# Altium schematic sheet Hum_ADC.SchDoc
size A4
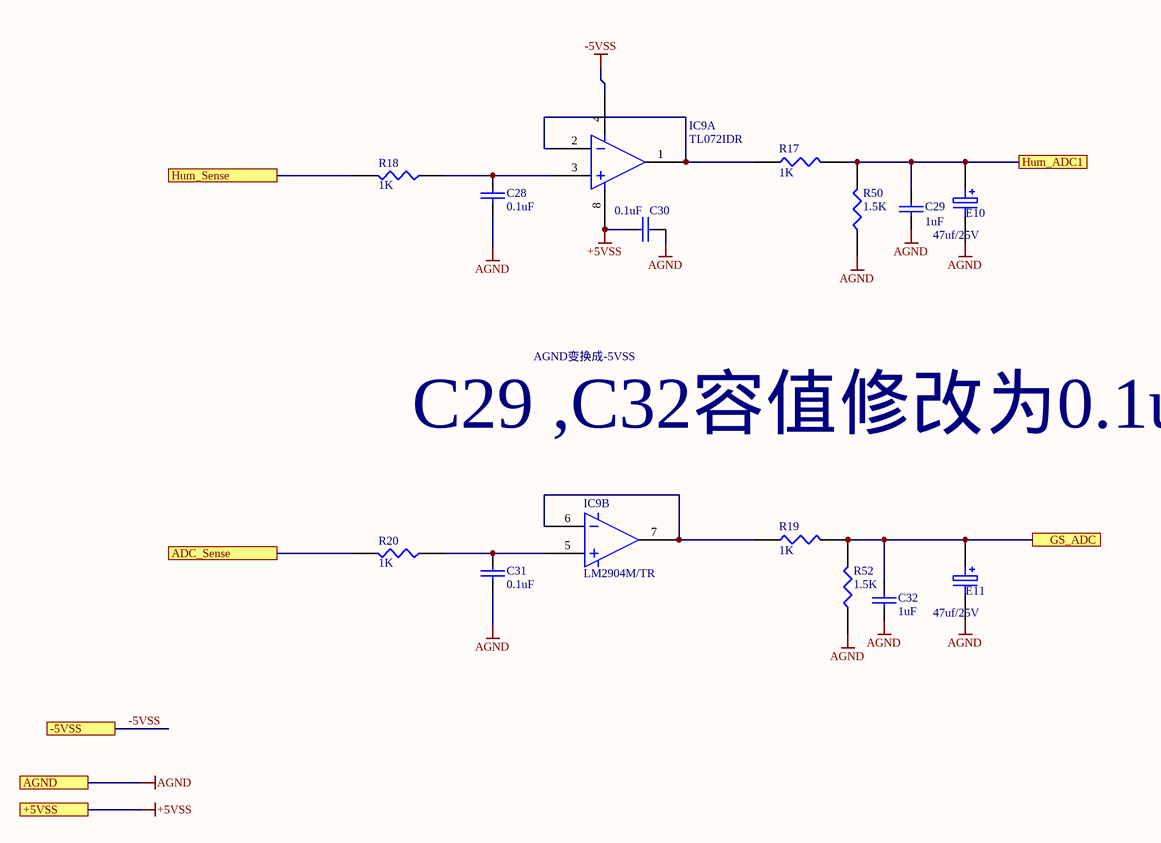
[diagram p0: Hum_ADC.SchDoc]

## Parts
C28  0.1uF  [0805C]
C29  1uF  [0805C]
C30  0.1uF  [0805C]
C31  0.1uF  [0805C]
C32  1uF  [0805C]
E10  47uf/25V  [CAP-TH_BD5.0-P2.00-D0.8-FD]
E11  47uf/25V  [CAP-TH_BD5.0-P2.00-D0.8-FD]
IC9  TL072IDR  [LM2904M/TR]  (parts A,B of 2)
R17  1K  [0805R]
R18  1K  [0805R]
R19  1K  [0805R]
R20  1K  [0805R]
R50  1.5K  [0805R]
R52  1.5K  [0805R]

## Ports
+5VSS, -5VSS, ADC_Sense, AGND, GS_ADC, Hum_ADC1, Hum_Sense

## Nets
+5VSS: C30.2 IC9.8 ; port +5VSS
-5VSS: IC9.4 ; port -5VSS
AGND: C28.2 C29.2 C30.1 C31.2 C32.2 E10.2 E11.2 R50.1 R52.1 ; port AGND
ADC_Sense: R20.2 ; port ADC_Sense
GS_ADC: C32.1 E11.1 R19.2 R52.2 ; port GS_ADC
Hum_ADC1: C29.1 E10.1 R17.2 R50.2 ; port Hum_ADC1
Hum_Sense: R18.2 ; port Hum_Sense
NetC28_1: C28.1 IC9.3 R18.1
NetC31_1: C31.1 IC9.5 R20.1
NetIC9_1: IC9.1 IC9.2 R17.1
NetIC9_6: IC9.6 IC9.7 R19.1

## Notes on the sheet
- AGND变换成-5VSS
- C29 ,C32容值修改为0.1uf

## Library data of the parts
C28-C32 = CAP: 品牌： SAMSUNG(三星) 型号： CL21B104KBCNNNC ：容值：100nF 精度：±10% 额定电压：50V 材质(温度系数)：X7R 材质:X7R
E10 E11 = ELECTRO1: 品牌： CX(承兴) 型号： KM108M025G17RR0VH2FP0 容值：1000uF 精度：±20% 额定电压：25V; Value: 1000uf/25V
IC9 = TL072: 品牌： HGSEMI(华冠)   型号： LM2904M/TR
R17-R20 R50 R52 = RES1: 品牌： UNI-ROYAL(厚声) 型号： 0805W8F1001T5E 电阻类型：厚膜电阻 阻值：1kΩ 精度：±1% 功率：125mW 温度系数：±100ppm/℃